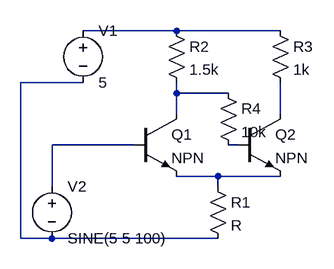
[diagram p0: schematic Draft14.asc]
Draft14.asc, the LTspice schematic file:
Version 4
SHEET 1 880 680
WIRE 480 112 336 112
WIRE 640 112 480 112
WIRE 336 192 240 192
WIRE 480 208 480 192
WIRE 560 208 480 208
WIRE 480 240 480 208
WIRE 640 240 640 192
WIRE 416 288 288 288
WIRE 576 288 560 288
WIRE 544 336 480 336
WIRE 640 336 544 336
WIRE 288 352 288 288
WIRE 544 352 544 336
WIRE 240 432 240 192
WIRE 288 432 240 432
WIRE 544 432 288 432
SYMBOL voltage 336 96 R0
SYMATTR InstName V1
SYMATTR Value 5
SYMBOL voltage 288 336 R0
SYMATTR InstName V2
SYMATTR Value SINE(5 5 100)
SYMBOL npn 416 240 R0
SYMATTR InstName Q1
SYMBOL npn 576 240 R0
SYMATTR InstName Q2
SYMBOL res 528 336 R0
SYMATTR InstName R1
SYMBOL res 464 96 R0
SYMATTR InstName R2
SYMATTR Value 1.5k
SYMBOL res 624 96 R0
SYMATTR InstName R3
SYMATTR Value 1k
SYMBOL res 544 192 R0
SYMATTR InstName R4
SYMATTR Value 10k

The netlist it stands for:
* Draft14.asc
V1 N001 N002 5
V2 N005 N002 SINE(5 5 100)
Q1 N003 N005 N007 0 NPN
Q2 N004 N006 N007 0 NPN
R1 N007 N002 R
R2 N001 N003 1.5k
R3 N001 N004 1k
R4 N003 N006 10k
.model NPN NPN
.model PNP PNP
.lib standard.bjt
.backanno
.end